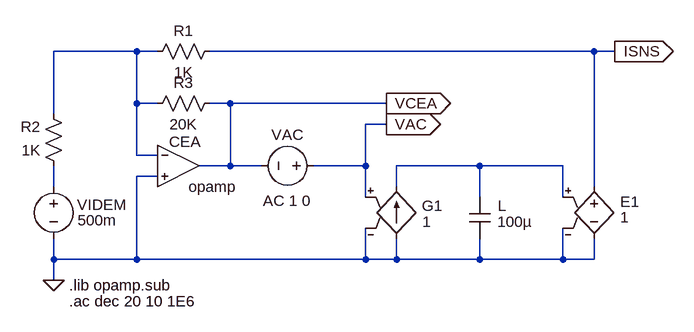
[diagram p0: schematic linmoda.asc]
linmoda.asc, the LTspice schematic file:
Version 4
SHEET 1 880 680
WIRE -304 112 -304 16
WIRE -304 224 -304 192
WIRE -304 336 -304 304
WIRE -304 368 -304 336
WIRE -176 16 -304 16
WIRE -176 96 -176 16
WIRE -176 176 -176 96
WIRE -176 336 -304 336
WIRE -176 336 -176 208
WIRE -144 16 -176 16
WIRE -144 96 -176 96
WIRE -144 176 -176 176
WIRE -144 208 -176 208
WIRE -32 96 -64 96
WIRE -32 192 -80 192
WIRE -32 192 -32 96
WIRE 16 192 -32 192
WIRE 176 192 96 192
WIRE 176 192 176 128
WIRE 176 240 176 192
WIRE 176 336 -176 336
WIRE 176 336 176 288
WIRE 208 96 -32 96
WIRE 208 128 176 128
WIRE 224 224 224 192
WIRE 224 336 176 336
WIRE 224 336 224 304
WIRE 352 192 224 192
WIRE 352 240 352 192
WIRE 352 336 224 336
WIRE 352 336 352 304
WIRE 480 192 352 192
WIRE 480 240 480 192
WIRE 480 336 352 336
WIRE 480 336 480 288
WIRE 528 16 -64 16
WIRE 528 224 528 16
WIRE 528 336 480 336
WIRE 528 336 528 304
WIRE 560 16 528 16
FLAG -304 368 0
FLAG 208 96 VCEA
IOPIN 208 96 Out
FLAG 208 128 VAC
IOPIN 208 128 Out
FLAG 560 16 ISNS
IOPIN 560 16 Out
SYMBOL cap 336 240 R0
WINDOW 0 44 13 Left 0
WINDOW 3 43 38 Left 0
SYMATTR InstName L
SYMATTR Value 100µ
SYMBOL g 224 208 R0
WINDOW 0 39 45 Left 0
WINDOW 3 40 70 Left 0
SYMATTR InstName G1
SYMATTR Value 1
SYMBOL Opamps\\opamp -112 128 R0
WINDOW 0 -14 27 Left 0
SYMATTR InstName CEA
SYMATTR SpiceLine2 GBW=2Meg
SYMBOL res -48 0 R90
WINDOW 0 0 56 VBottom 0
WINDOW 3 32 56 VTop 0
SYMATTR InstName R1
SYMATTR Value 1K
SYMBOL res -288 208 R180
WINDOW 0 36 76 Left 0
WINDOW 3 36 40 Left 0
SYMATTR InstName R2
SYMATTR Value 1K
SYMBOL res -160 112 R270
WINDOW 0 32 56 VTop 0
WINDOW 3 0 56 VBottom 0
SYMATTR InstName R3
SYMATTR Value 20K
SYMBOL voltage -304 208 R0
WINDOW 0 36 44 Left 0
WINDOW 3 37 68 Left 0
SYMATTR InstName VIDEM
SYMATTR Value 500m
SYMBOL e 528 208 R0
WINDOW 0 40 39 Left 0
WINDOW 3 40 63 Left 0
SYMATTR InstName E1
SYMATTR Value 1
SYMBOL voltage 112 192 R90
WINDOW 0 -32 56 VBottom 0
WINDOW 3 32 56 VTop 0
WINDOW 123 38 57 VTop 0
WINDOW 39 0 0 Left 0
SYMATTR InstName VAC
SYMATTR Value ""
SYMATTR Value2 AC 1 0
TEXT -280 376 Left 0 !.lib opamp.sub
TEXT -280 400 Left 0 !.ac dec 20 10 1E6

The netlist it stands for:
* linmoda.asc
C§L N003 0 100µ
G1 0 N003 VAC 0 1
XCEA N001 0 VCEA opamp Aol=100K GBW=2Meg  ; pins invin noninvin out
R1 ISNS N001 1K
R2 N002 N001 1K
R3 N001 VCEA 20K
VIDEM N002 0 500m
E1 ISNS 0 N003 0 1
VAC VAC VCEA AC 1 0
.lib opamp.sub
.ac dec 20 10 1E6
.backanno
.end